# EAGLE design Kap_Regensensor_v4 (EAGLE 7.3.0)
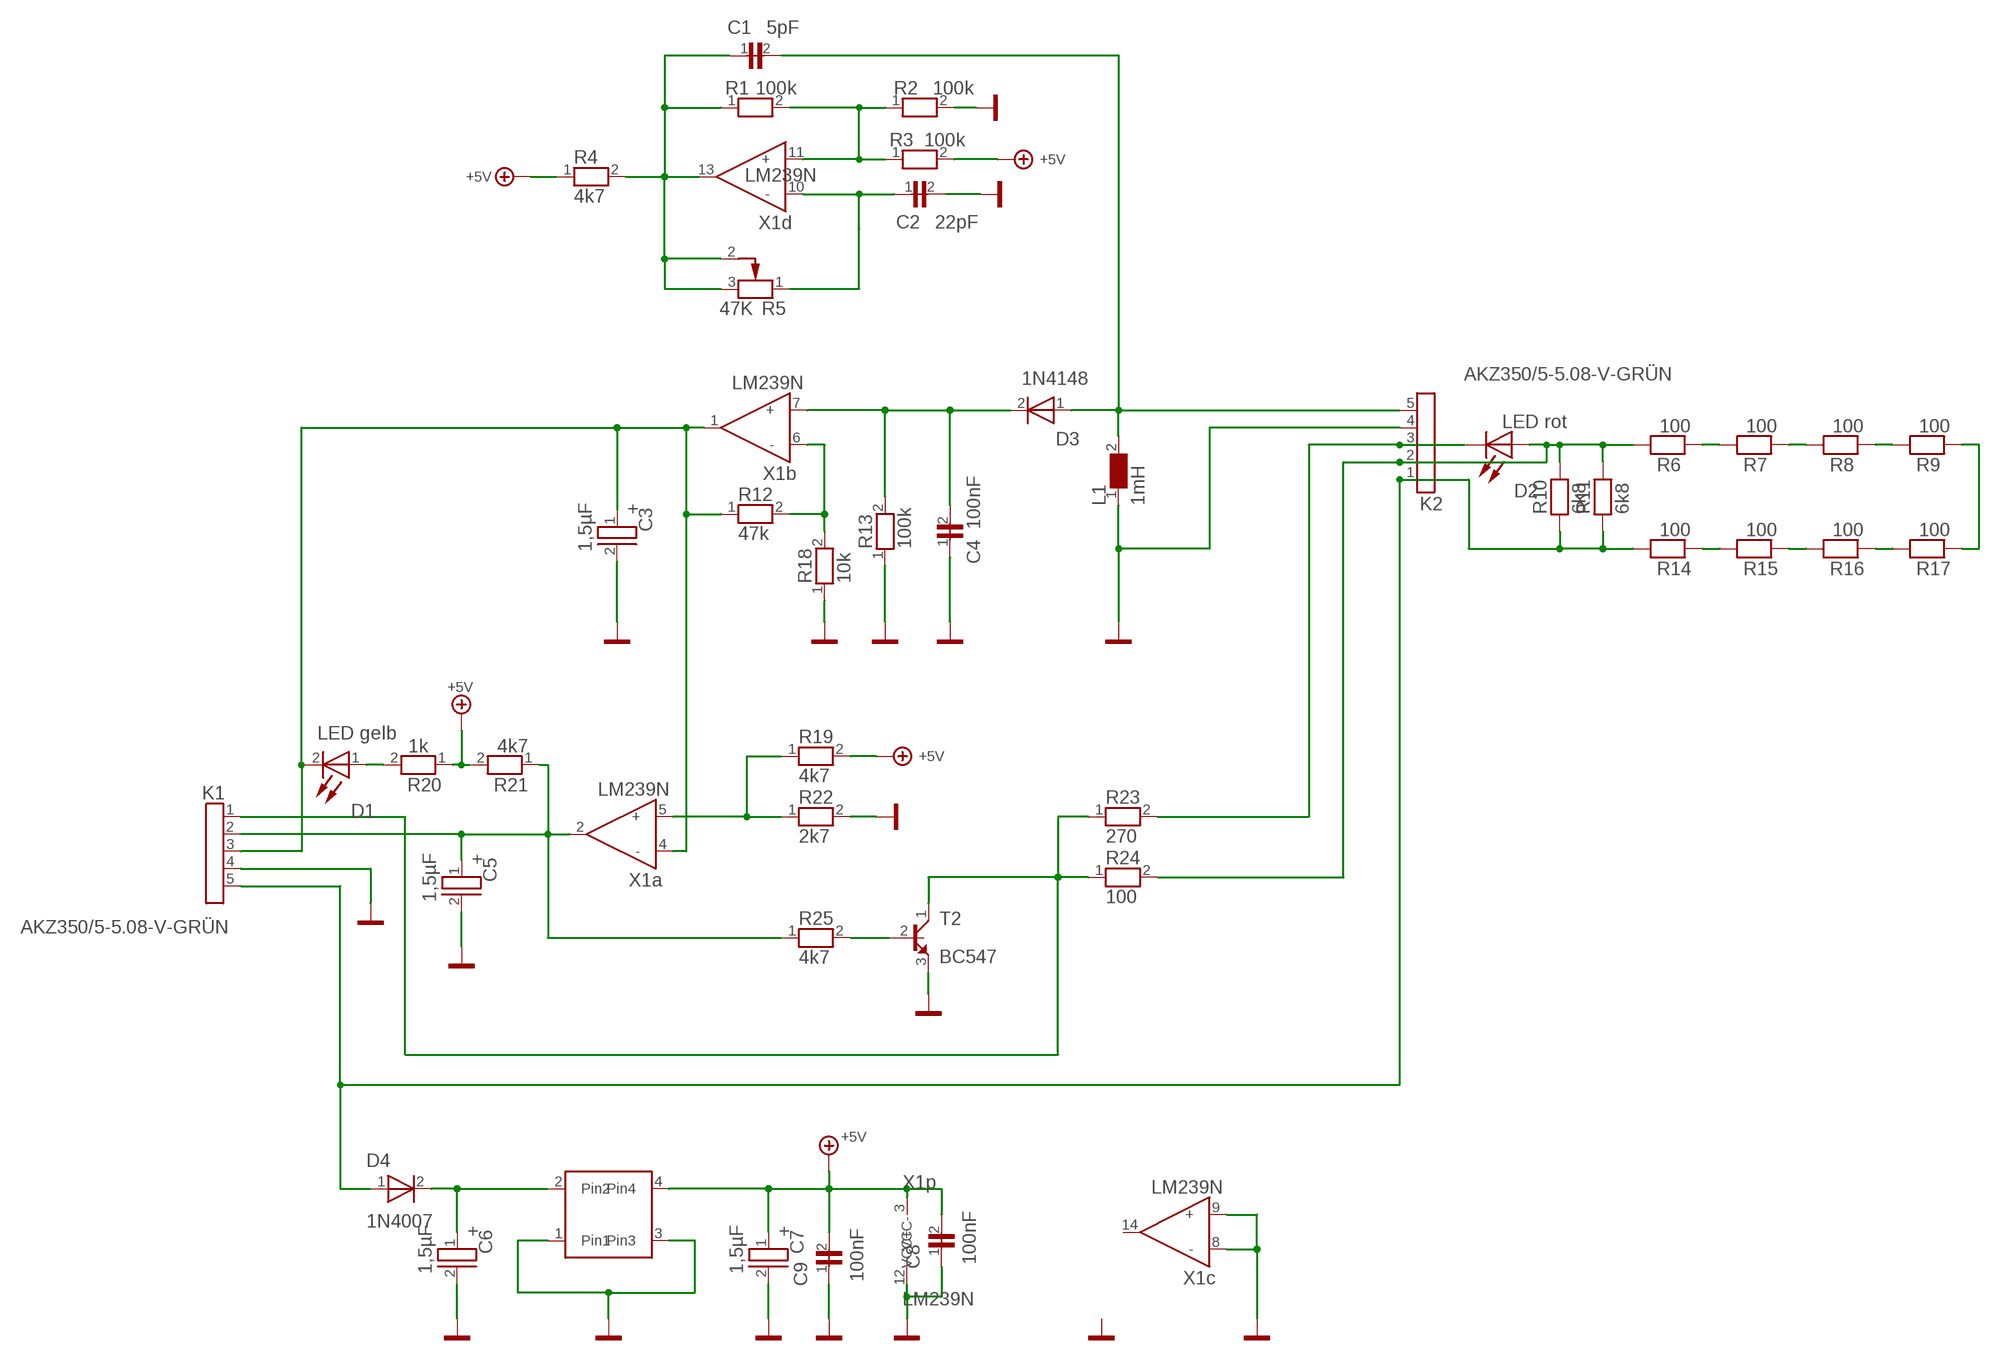
[diagram p0: schematic, sheet 1]

## Parts
C1  5pF  222268034478_9  [3X5R2,54_9]
C2  22pF  222268034229_12  [3X5R2,54_12]
C3  1,5µF  489D_25V_1,5µF_23  [D4R2,54_ELKO_23]
C4  100nF  B37982-N5104-M_10  [3X5R2,54_10]
C5  1,5µF  489D_25V_1,5µF_43  [D4R2,54_ELKO_43]
C6  1,5µF  489D_25V_1,5µF_25  [D4R2,54_ELKO_25]
C7  1,5µF  489D_25V_1,5µF_26  [D4R2,54_ELKO_26]
C8  100nF  B37982-N5104-M_52  [3X5R2,54_52]
C9  100nF  B37982-N5104-M_27  [3X5R2,54_27]
D1  LED gelb  LED_ROT_5MM_37  [LED_5MM_ROT_37]
D2  LED rot  LED_ROT_5MM_38  (no package)
D3  1N4148  1N4148_11  [DO35_11]
D4  1N4007  1N4007_28  [D_RM12,7_DM3_28]
IC1  StepDown  StepDown_66  [StepDown_66]
K1  AKZ350/5-5.08-V-GRÜN  AKZ350/5-5.08-V-GRÜN_22  [Schraubklemme_5POLx5.08_22]
K2  AKZ350/5-5.08-V-GRÜN  AKZ350/5-5.08-V-GRÜN_21  [Schraubklemme_5POLx5.08_21]
L1  1mH  L-1MH_29  [5X8R5,08_29]
R1  100k  R_KOHLE_10K_0204_4  [0204_STEHEND_4]
R2  100k  R_KOHLE_10K_0204_5  [0204_5]
R3  100k  R_KOHLE_10K_0204_6  [0204_6]
R4  4k7  R_KOHLE_10K_0204_1  [0204_1]
R5  47K  TRIMMER-70UHWTD-K-P-C_47-KOHM_7  [TRIMMER_70WTD-K-P-C_7]
R6  100  R_KOHLE_10K_0204_58  (no package)
R7  100  R_KOHLE_10K_0204_59  (no package)
R8  100  R_KOHLE_10K_0204_60  (no package)
R9  100  R_KOHLE_10K_0204_61  (no package)
R10  6k8  R_KOHLE_10K_0204_62  (no package)
R11  6k8  R_KOHLE_10K_0204_63  (no package)
R12  47k  R_KOHLE_10K_0204_3  [0204_3]
R13  100k  R_KOHLE_10K_0204_8  [0204_STEHEND_8]
R14  100  R_KOHLE_10K_0204_54  (no package)
R15  100  R_KOHLE_10K_0204_55  (no package)
R16  100  R_KOHLE_10K_0204_56  (no package)
R17  100  R_KOHLE_10K_0204_57  (no package)
R18  10k  R_KOHLE_10K_0204_2  [0204_STEHEND_2]
R19  4k7  R_KOHLE_10K_0204_30  [0204_STEHEND_30]
R20  1k  R_KOHLE_10K_0204_36  [0204_36]
R21  4k7  R_KOHLE_10K_0204_35  [0204_STEHEND_35]
R22  2k7  R_KOHLE_10K_0204_31  [0204_STEHEND_31]
R23  270  R_KOHLE_10K_0204_33  [0204_STEHEND_33]
R24  100  R_KOHLE_10K_0204_34  [0204_STEHEND_34]
R25  4k7  R_KOHLE_10K_0204_32  [0204_32]
T2  BC547  BC547_45  [TO92_45]
X1  LM239N  LM239N_0  [DIL14_0]

## Nets
1: R1.2 R2.1 R3.1 X1.11(d:+)
3: K2.3 R23.2
5: D4.1(A) K1.5 K2.1
+: C4.2 D3.2(K) R13.2 X1.7(b:+)
+5V: C7.1(+) C8.2 C9.2 IC1.4(Pin4) R3.2 R4.1 R19.2 R20.1 R21.2 X1.3(p:VCC+)
-: C2.1 R5.1(A) X1.10(d:-)
A: C1.1 R1.1 R4.2 R5.2(S) R5.3(E) X1.13(d:OUT)
GND: C2.2 C3.2(-) C4.1 C5.2(-) C6.2(-) C7.2(-) C8.1 C9.1 IC1.1(Pin1) IC1.3(Pin3) K1.4 K2.4 L1.1 R2.2 R13.1 R18.1 R22.2 T2.3(E) X1.8(c:-) X1.9(c:+) X1.12(p:VCC-)
OUT: C3.1(+) D1.2(K) K1.3 R12.1 X1.1(b:OUT) X1.4(a:-)
Sig$8: R12.2 R18.2 X1.6(b:-)
Sig$9: C1.2 D3.1(A) K2.5 L1.2
Sig$10: C5.1(+) K1.2 R21.1 R25.1 X1.2(a:OUT)
Sig$11: D1.1(A) R20.2
Sig$12: R19.1 R22.1 X1.5(a:+)
Sig$13: R25.2 T2.2(B)
Sig$14: K1.1 R23.1 R24.1 T2.1(C)
Sig$16: C6.1(+) D4.2(K) IC1.2(Pin2)
Sig$25: K2.2 R24.2
Unconnected: D2.A D2.K R6.1 R6.2 R7.1 R7.2 R8.1 R8.2 R9.1 R9.2 R10.1 R10.2 R11.1 R11.2 R14.1 R14.2 R15.1 R15.2 R16.1 R16.2 R17.1 R17.2 X1.14(c:OUT)

## Library data of the parts
C1 = TARGET3001!_V18.9.0.22:222268034478_9: Keramischer Rechteckkondensator
C2 = TARGET3001!_V18.9.0.22:222268034229_12: Keramischer Rechteckkondensator
C3 = TARGET3001!_V18.9.0.22:489D_25V_1,5µF_23: Tantalkondensatoren tropfenförmig, 489 D, Tantal-Elko 1,5uF 25V , 489D155X0025B1V [1,5UF]
C4 = TARGET3001!_V18.9.0.22:B37982-N5104-M_10: Bedrahtete Keramikkondensatoren, X7R/Z5U/Y5U, Kondensator 50V , B37982-N5104-M [100NF]
C5 = TARGET3001!_V18.9.0.22:489D_25V_1,5µF_43: Tantalkondensatoren tropfenförmig, 489 D, Tantal-Elko 1,5uF 25V , 489D155X0025B1V [1,5UF]
C6 = TARGET3001!_V18.9.0.22:489D_25V_1,5µF_25: Tantalkondensatoren tropfenförmig, 489 D, Tantal-Elko 1,5uF 25V , 489D155X0025B1V [1,5UF]
C7 = TARGET3001!_V18.9.0.22:489D_25V_1,5µF_26: Tantalkondensatoren tropfenförmig, 489 D, Tantal-Elko 1,5uF 25V , 489D155X0025B1V [1,5UF]
C8 = TARGET3001!_V18.9.0.22:B37982-N5104-M_52: Bedrahtete Keramikkondensatoren, X7R/Z5U/Y5U, Kondensator 50V , B37982-N5104-M [100NF]
C9 = TARGET3001!_V18.9.0.22:B37982-N5104-M_27: Bedrahtete Keramikkondensatoren, X7R/Z5U/Y5U, Kondensator 50V , B37982-N5104-M [100NF]
D1 = TARGET3001!_V18.9.0.22:LED_ROT_5MM_37: Leuchtdiode 5mm, Rot
D2 = TARGET3001!_V18.9.0.22:LED_ROT_5MM_38: Leuchtdiode 5mm, Rot
D3 = TARGET3001!_V18.9.0.22:1N4148_11: Universal-Diode 75V, 200mA, trr:4ns
D4 = TARGET3001!_V18.9.0.22:1N4007_28: Universal-Diode 1000V, 1A
IC1 = TARGET3001!_V18.9.0.22:StepDown_66
K1 = TARGET3001!_V18.9.0.22:AKZ350/5-5.08-V-GRÜN_22: Schraubklemme 5-polig RM5,08
K2 = TARGET3001!_V18.9.0.22:AKZ350/5-5.08-V-GRÜN_21: Schraubklemme 5-polig RM5,08
L1 = TARGET3001!_V18.9.0.22:L-1MH_29: DROSSEL 1MH Miniatur-Festinduktivitäten Anwendung: Entkopplung, Entzerrung bzw. Entstörung im HF/NF-Bereich und in selektiven Schaltungen. Ferritkern im Kunststoffgehäuse, radiale Anschlussdrähte im Raster 5 mm. Toleranz: ±5%. Zulässige Verlustleistung bei 40 °C/240 mW. Abm. 7,5 x 10,5 x 4,8 mm. Wert 1 mH ; Q bei 65 ; f MHz 0,6 ; R Ohm 14 ; I mA 130 ; Fres MHz 1,
R1 = TARGET3001!_V18.9.0.22:R_KOHLE_10K_0204_4: Kohleschichtwiderstand 10K-Ohm, 0,1W, 5%
R2 = TARGET3001!_V18.9.0.22:R_KOHLE_10K_0204_5: Kohleschichtwiderstand 10K-Ohm, 0,1W, 5%
R3 = TARGET3001!_V18.9.0.22:R_KOHLE_10K_0204_6: Kohleschichtwiderstand 10K-Ohm, 0,1W, 5%
R4 = TARGET3001!_V18.9.0.22:R_KOHLE_10K_0204_1: Kohleschichtwiderstand 10K-Ohm, 0,1W, 5%
R5 = TARGET3001!_V18.9.0.22:TRIMMER-70UHWTD-K-P-C_47-KOHM_7: Cermet-Trimmer, 70 WTD-K-P-C, Trimmpotentiometer , 70UHWTD-K-P-C [47KOHM]
R6 = TARGET3001!_V18.9.0.22:R_KOHLE_10K_0204_58: Kohleschichtwiderstand 10K-Ohm, 0,1W, 5%
R7 = TARGET3001!_V18.9.0.22:R_KOHLE_10K_0204_59: Kohleschichtwiderstand 10K-Ohm, 0,1W, 5%
R8 = TARGET3001!_V18.9.0.22:R_KOHLE_10K_0204_60: Kohleschichtwiderstand 10K-Ohm, 0,1W, 5%
R9 = TARGET3001!_V18.9.0.22:R_KOHLE_10K_0204_61: Kohleschichtwiderstand 10K-Ohm, 0,1W, 5%
R10 = TARGET3001!_V18.9.0.22:R_KOHLE_10K_0204_62: Kohleschichtwiderstand 10K-Ohm, 0,1W, 5%
R11 = TARGET3001!_V18.9.0.22:R_KOHLE_10K_0204_63: Kohleschichtwiderstand 10K-Ohm, 0,1W, 5%
R12 = TARGET3001!_V18.9.0.22:R_KOHLE_10K_0204_3: Kohleschichtwiderstand 10K-Ohm, 0,1W, 5%
R13 = TARGET3001!_V18.9.0.22:R_KOHLE_10K_0204_8: Kohleschichtwiderstand 10K-Ohm, 0,1W, 5%
R14 = TARGET3001!_V18.9.0.22:R_KOHLE_10K_0204_54: Kohleschichtwiderstand 10K-Ohm, 0,1W, 5%
R15 = TARGET3001!_V18.9.0.22:R_KOHLE_10K_0204_55: Kohleschichtwiderstand 10K-Ohm, 0,1W, 5%
R16 = TARGET3001!_V18.9.0.22:R_KOHLE_10K_0204_56: Kohleschichtwiderstand 10K-Ohm, 0,1W, 5%
R17 = TARGET3001!_V18.9.0.22:R_KOHLE_10K_0204_57: Kohleschichtwiderstand 10K-Ohm, 0,1W, 5%
R18 = TARGET3001!_V18.9.0.22:R_KOHLE_10K_0204_2: Kohleschichtwiderstand 10K-Ohm, 0,1W, 5%
R19 = TARGET3001!_V18.9.0.22:R_KOHLE_10K_0204_30: Kohleschichtwiderstand 10K-Ohm, 0,1W, 5%
R20 = TARGET3001!_V18.9.0.22:R_KOHLE_10K_0204_36: Kohleschichtwiderstand 10K-Ohm, 0,1W, 5%
R21 = TARGET3001!_V18.9.0.22:R_KOHLE_10K_0204_35: Kohleschichtwiderstand 10K-Ohm, 0,1W, 5%
R22 = TARGET3001!_V18.9.0.22:R_KOHLE_10K_0204_31: Kohleschichtwiderstand 10K-Ohm, 0,1W, 5%
R23 = TARGET3001!_V18.9.0.22:R_KOHLE_10K_0204_33: Kohleschichtwiderstand 10K-Ohm, 0,1W, 5%
R24 = TARGET3001!_V18.9.0.22:R_KOHLE_10K_0204_34: Kohleschichtwiderstand 10K-Ohm, 0,1W, 5%
R25 = TARGET3001!_V18.9.0.22:R_KOHLE_10K_0204_32: Kohleschichtwiderstand 10K-Ohm, 0,1W, 5%
T2 = TARGET3001!_V18.9.0.22:BC547_45: Bipolar-Standard-Leistungstransistor UCE:45V, ICE:0,2A, max800
X1 = TARGET3001!_V18.9.0.22:LM239N_0

## Board
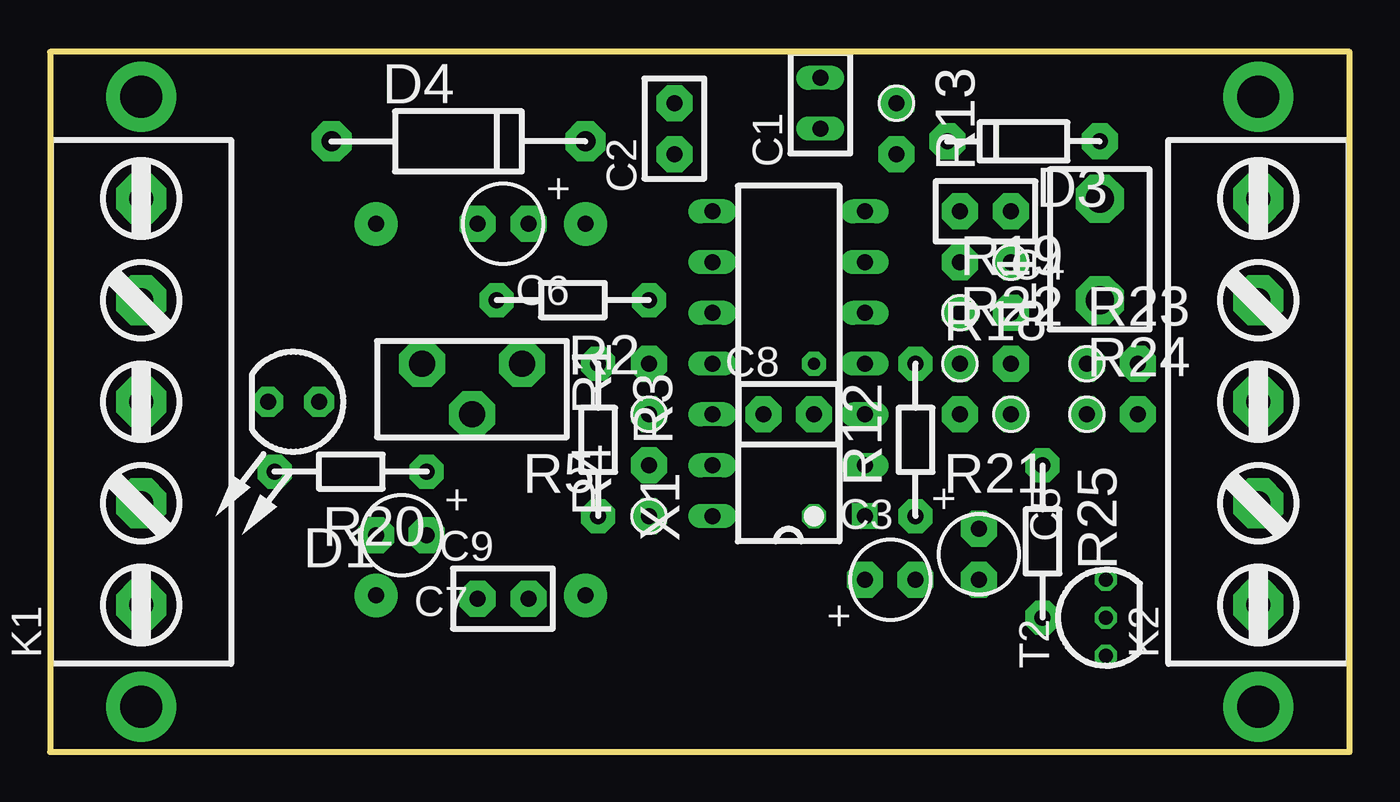
[diagram p1: board, top side]
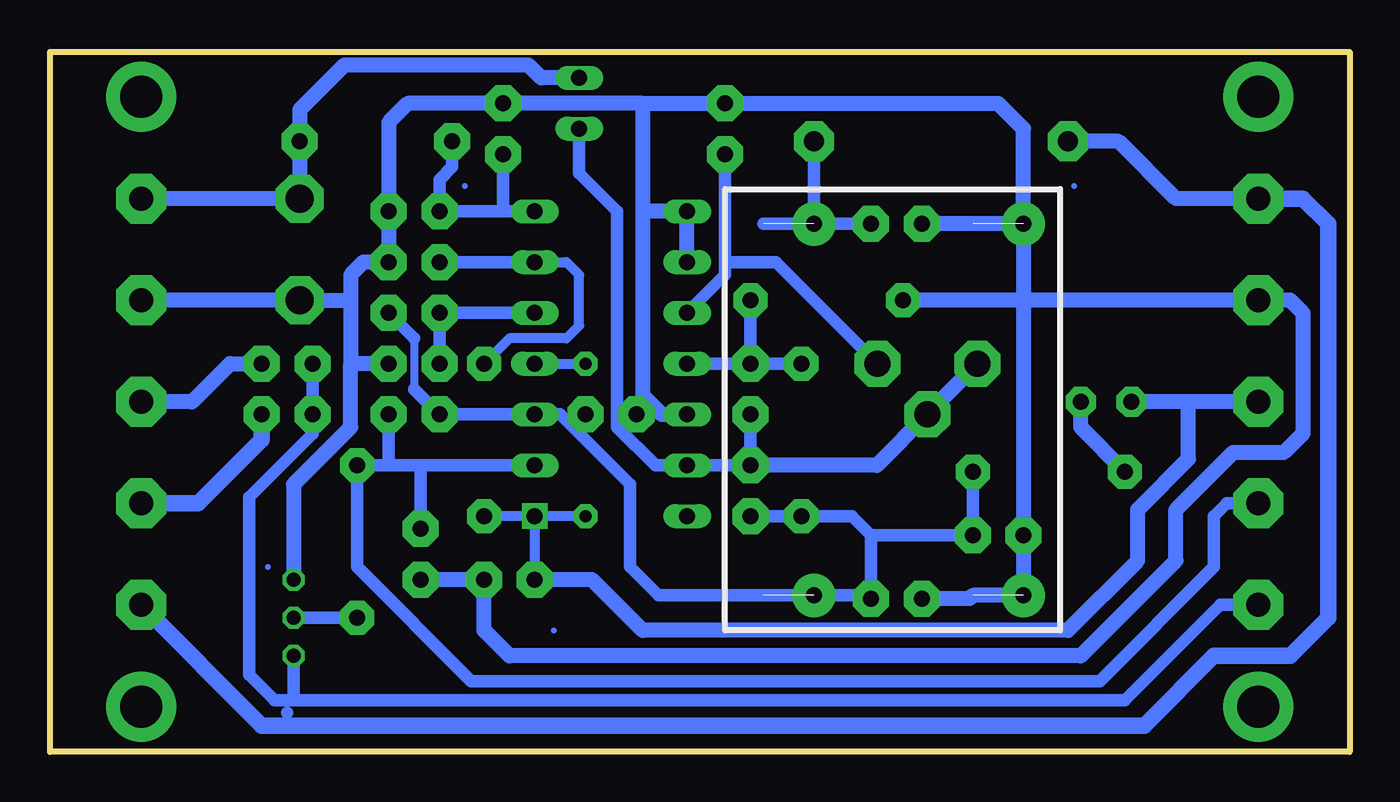
[diagram p2: board, bottom side, seen from below]

Size 65 x 35 mm. Coordinates in mm from the lower left corner, seen from the top.
Outline: 0,35 0,0 65,0 65,35 0,35
Copper layers (1*16): Top 0.035mm / dielectric 1.5mm / Bottom 0.035mm
Design rules "TARGET3001!": minimum track width 0.3mm, minimum drill 0.6mm, track to track 0.2mm, track to pad 0.2mm, pad to pad 0.2mm, via to via 0.2mm, smd to smd 0mm, copper to edge 0mm, drill to drill 0.3mm, minimum pad ring 0.2mm, minimum via ring 0.3mm, stop-mask expansion 4mil, vias tented up to drill 0mil, thermal gap 10mil

### Footprints (pad centres in the part's own frame; a part is rotated, then mirrored left to right if it is on the bottom)
3X5R2,54_9 = drill 0.8 pad 0.235 long: 1 0,-1.27; 2 0,1.27
3X5R2,54_12 = drill 0.8 pad 1.8 octagon: 1 0,-1.27; 2 0,1.27
D4R2,54_ELKO_23 = drill 0.8 pad 1.8 octagon: 1 -1.27,0; 2 1.27,0
3X5R2,54_10 = drill 0.8 pad 1.8 octagon: 1 1.27,0; 2 -1.27,0
D4R2,54_ELKO_43 = drill 0.8 pad 1.8 octagon: 1 0,1.27; 2 0,-1.27
D4R2,54_ELKO_25 = drill 0.8 pad 1.8 octagon: 1 1.27,0; 2 -1.27,0
D4R2,54_ELKO_26 = drill 0.8 pad 1.8 octagon: 1 1.27,0; 2 -1.27,0
3X5R2,54_52 = drill 0.8 pad 1.8 octagon: 1 -1.27,0; 2 1.27,0
3X5R2,54_27 = drill 0.8 pad 1.8 octagon: 1 -1.27,0; 2 1.27,0
LED_5MM_ROT_37 = drill 0.8 pad 1.5 octagon: 1 1.27,0; 2 -1.27,0
DO35_11 = drill 0.8 pad 1.8 octagon: 1 3.81,0; 2 -3.81,0
D_RM12,7_DM3_28 = drill 1 pad 2 octagon: 1 -6.35,0; 2 6.35,0
StepDown_66 = drill 0.8 pad 2.159 round: 1 -14.922,-1.746; 2 -4.445,-1.746; 3 -14.922,-20.32; 4 -4.445,-20.32
Schraubklemme_5POLx5.08_22 = drill 1.2 pad 2.5 octagon: 1 0,-10.16; 2 0,-5.08; 3 0,0; 4 0,5.08; 5 0,10.16
Schraubklemme_5POLx5.08_21 = drill 1.2 pad 2.5 octagon: 1 0,-10.16; 2 0,-5.08; 3 0,0; 4 0,5.08; 5 0,10.16
5X8R5,08_29 = drill 1.4 pad 2.4 octagon: 1 0,-2.54; 2 0,2.54
0204_STEHEND_4 = drill 0.8 pad 1.8 octagon: 1 0,0; 2 0,2.54
0204_5 = drill 0.8 pad 1.7 octagon: 1 3.81,0; 2 -3.81,0
0204_6 = drill 0.8 pad 1.7 octagon: 1 0,3.81; 2 0,-3.81
0204_1 = drill 0.8 pad 1.8 octagon: 1 0,0; 2 0,2.54
TRIMMER_70WTD-K-P-C_7 = drill 1.3 pad 2.3 octagon: 1 2.5,1.27; 2 -2.5,1.27; 3 0,-1.27
0204_3 = drill 0.8 pad 1.7 octagon: 1 0,-3.81; 2 0,3.81
0204_STEHEND_8 = drill 0.8 pad 1.8 octagon: 1 0,0; 2 0,-2.54
0204_STEHEND_2 = drill 0.8 pad 1.8 octagon: 1 0,0; 2 -2.54,0
0204_STEHEND_30 = drill 0.8 pad 1.8 octagon: 1 0,0; 2 2.54,0
0204_36 = drill 0.8 pad 1.7 octagon: 1 3.81,0; 2 -3.81,0
0204_STEHEND_35 = drill 0.8 pad 1.8 octagon: 1 0,0; 2 -2.54,0
0204_STEHEND_31 = drill 0.8 pad 1.8 octagon: 1 0,0; 2 2.54,0
0204_STEHEND_33 = drill 0.8 pad 1.8 octagon: 1 0,0; 2 2.54,0
0204_STEHEND_34 = drill 0.8 pad 1.8 octagon: 1 0,0; 2 2.54,0
0204_32 = drill 0.8 pad 1.7 octagon: 1 0,3.81; 2 0,-3.81
TO92_45 = drill 0.7 pad 1.1 octagon: 1 0,-1.905; 2 0,0; 3 0,1.905
DIL14_0 = drill 0.8 pad 1.27 square: 1 3.81,-7.62 | drill 0.8 pad 0.235 long: 2 3.81,-5.08; 3 3.81,-2.54; 4 3.81,0; 5 3.81,2.54; 6 3.81,5.08; 7 3.81,7.62; 8 -3.81,7.62; 9 -3.81,5.08; 10 -3.81,2.54; 11 -3.81,0; 12 -3.81,-2.54; 13 -3.81,-5.08; 14 -3.81,-7.62

### Placement (x,y rotation side)
C1  38.53,32.42 0 top
C2  31.23,31.15 0 top
C3  42.02,8.61 0 top
C4  46.79,27.02 0 top
C5  46.47,9.88 0 top
C6  22.66,26.39 0 top
C7  17.58,10.83 0 top
C8  36.95,16.86 0 top
C9  22.66,7.66 0 top
D1  12.18,17.5 0 top
D3  48.69,30.52 0 top
D4  20.43,30.52 0 top
IC1  31.23,28.14 0 top
K1  4.56,17.5 0 top
K2  60.44,17.5 0 top
L1  52.5,25.12 0 top
R1  29.96,16.86 0 top
R2  26.15,22.58 0 top
R3  27.42,15.59 0 top
R4  29.96,11.79 0 top
R5  21.11,18.13 0 top
R12  43.3,15.59 0 top
R13  42.34,32.42 0 top
R18  48.06,24.48 0 top
R19  45.52,21.95 0 top
R20  15.04,14.01 0 top
R21  48.06,16.86 0 top
R22  45.52,19.41 0 top
R23  51.87,19.41 0 top
R24  51.87,16.86 0 top
R25  49.65,10.51 0 top
T2  52.82,6.71 0 top
X1  36.95,19.41 0 top

### Tracks (layer width: path | path; a pad name or v marks a point on that pad's centre or on a via)
1
  Bottom 0.3: R1.2
  Bottom 0.635: R1.2 X1.11 | R2.1 R1.2 | R1.2 R3.1
3
  Bottom 0.762: R23.2 56,19.41 57.9,17.5 K2.3
5
  Bottom 0.762: K1.5 8.69,27.66 11.54,30.52 D4.1
  Bottom 0.813: K1.5 2.34,27.66 1.07,26.39 1.07,6.7 2.97,4.8 6.78,4.8 10.28,1.31 54.41,1.31 K2.1
+
  Bottom 0.635: X1.7 42.34,27.02 | R13.2 42.34,27.02 | 42.34,27.02 C4.2 45.52,28.61 44.88,29.25 D3.2
+5V
  Bottom 0.3: 39.8,6.07
  Bottom 0.406: 46.79,20.68 46.79,18.13
  Bottom 0.635: R19.2 46.79,20.68 | 46.79,18.13 R21.2 X1.3 39.48,16.86 35.99,13.37 35.99,9.24 34.56,7.82 IC1.4 24.09,7.82 C9.2 23.93,10.83 | R20.1 C7.1 23.93,10.83 | R4.1 R3.2 24.88,11.79 23.93,10.83
-
  Bottom 0.508: R5.1
  Bottom 0.635: 31.23,24.48 31.23,23.85 X1.10 | R5.1 28.69,24.48 31.23,24.48 | 31.23,24.48 C2.1
A
  Bottom 0.3: 21.11,16.91 R5.3
  Bottom 0.635: R1.1 R4.2 X1.13 34.72,14.32 36.63,16.23 36.63,27.02 38.53,28.93 C1.1 | 35.04,14.64
  Bottom 0.762: R4.2 23.65,14.32 R5.3 | R5.2 21.11,16.91
GND
  Bottom 0.3: R18.1 | 44.25,28.29
  Bottom 0.762: K2.4 L1.1 49.96,22.58 | IC1.1 16.31,22.58 | C9.1 19.01,7.66 18.85,7.82 IC1.3 C7.2 16.31,22.58 | IC1.1 C6.2 | 16.31,22.58 K1.4 2.97,22.58 2.34,21.95 2.34,15.91 3.29,14.96 5.83,14.96 8.69,12.1 8.69,9.56 13.45,4.8 42.02,4.8 43.3,6.07 C3.2 C5.2 | 35.36,32.42 C2.2 17.58,32.42 16.31,31.15 IC1.1 | 35.36,32.42 35.36,27.02 | 35.36,32.42 R13.1 47.11,32.42 48.06,31.47 C4.1 R18.1 49.33,24.48 49.96,23.85 49.96,22.58 | X1.12 34.41,16.86 35.36,17.82 35.36,27.02 | 16.31,22.58 R2.2 | R22.2 49.96,19.41 | 49.96,19.41 49.96,16.23 52.82,13.37 T2.3 | 49.96,22.58 49.96,19.41 | X1.9 X1.8 35.36,27.02
OUT  (via drill 0.6 pad 1.2)
  Bottom 0.3: 13.77,28.29
  Bottom 0.508: X1.1 C3.1 | X1.1 R12.1 | X1.4 v38.22,19.41 | v38.22,11.79 X1.1
  Bottom 0.762: K1.3 8.05,17.5 | 8.05,17.5 8.05,14.64 10.59,12.1 10.59,9.56 14.09,6.07 35.36,6.07 37.9,8.61 C3.1 | 8.05,17.5 D1.2
Sig$8
  Bottom 0.508: X1.6 39.17,24.48 38.53,23.85 38.53,21.31 39.17,20.68 42.02,20.68 R12.2
  Bottom 0.635: X1.6 R18.2
Sig$9
  Bottom 0.762: K2.5 L1.2 D3.1 52.5,32.11 50.28,34.33 41.07,34.33 40.44,33.69 C1.2
Sig$10
  Bottom 0.508: 47.74,7.34
  Bottom 0.635: K1.2 6.15,12.42 6.78,11.79 6.78,9.24 12.5,3.53 43.93,3.53 49.65,9.24 R25.1 48.06,14.32 | R21.1 48.06,14.32 | X1.2 46.47,14.32 | C5.1 46.47,14.32 | 46.47,14.32 48.06,14.32
Sig$11
  Bottom 0.762: R20.2 13.45,16.23 D1.1
Sig$12
  Bottom 0.635: X1.5 R19.1 R22.1
Sig$13
  Bottom 0.635: R25.2 T2.2
Sig$14
  Bottom 0.3: 54.09,9.24
  Bottom 0.508: 51.87,15.91 R24.1
  Bottom 0.635: R23.1 R24.1 | 52.82,2.58 11.23,2.58 6.46,7.34 K1.1 | 51.87,15.91 55.04,12.74 55.04,3.85 53.77,2.58 52.82,2.58 | 52.82,2.58 T2.1 | 53.14,1.94
Sig$16
  Bottom 0.635: D4.2 IC1.2 | IC1.2 29.32,26.39 | C6.1 IC1.2
Sig$25
  Bottom 0.813: R24.2 54.41,15.59 57.58,12.42 K2.2
WITHOUT_SIGNAL  (via drill 2.1 pad 3.5)
  other vias: 60.44,32.74 4.56,32.74 60.44,2.26 4.56,2.26

### Text on the board
Measures: 34,9625 | -0,0375 | -0,115 | 64,885